# EAGLE design stm32 (EAGLE 7.2.0)
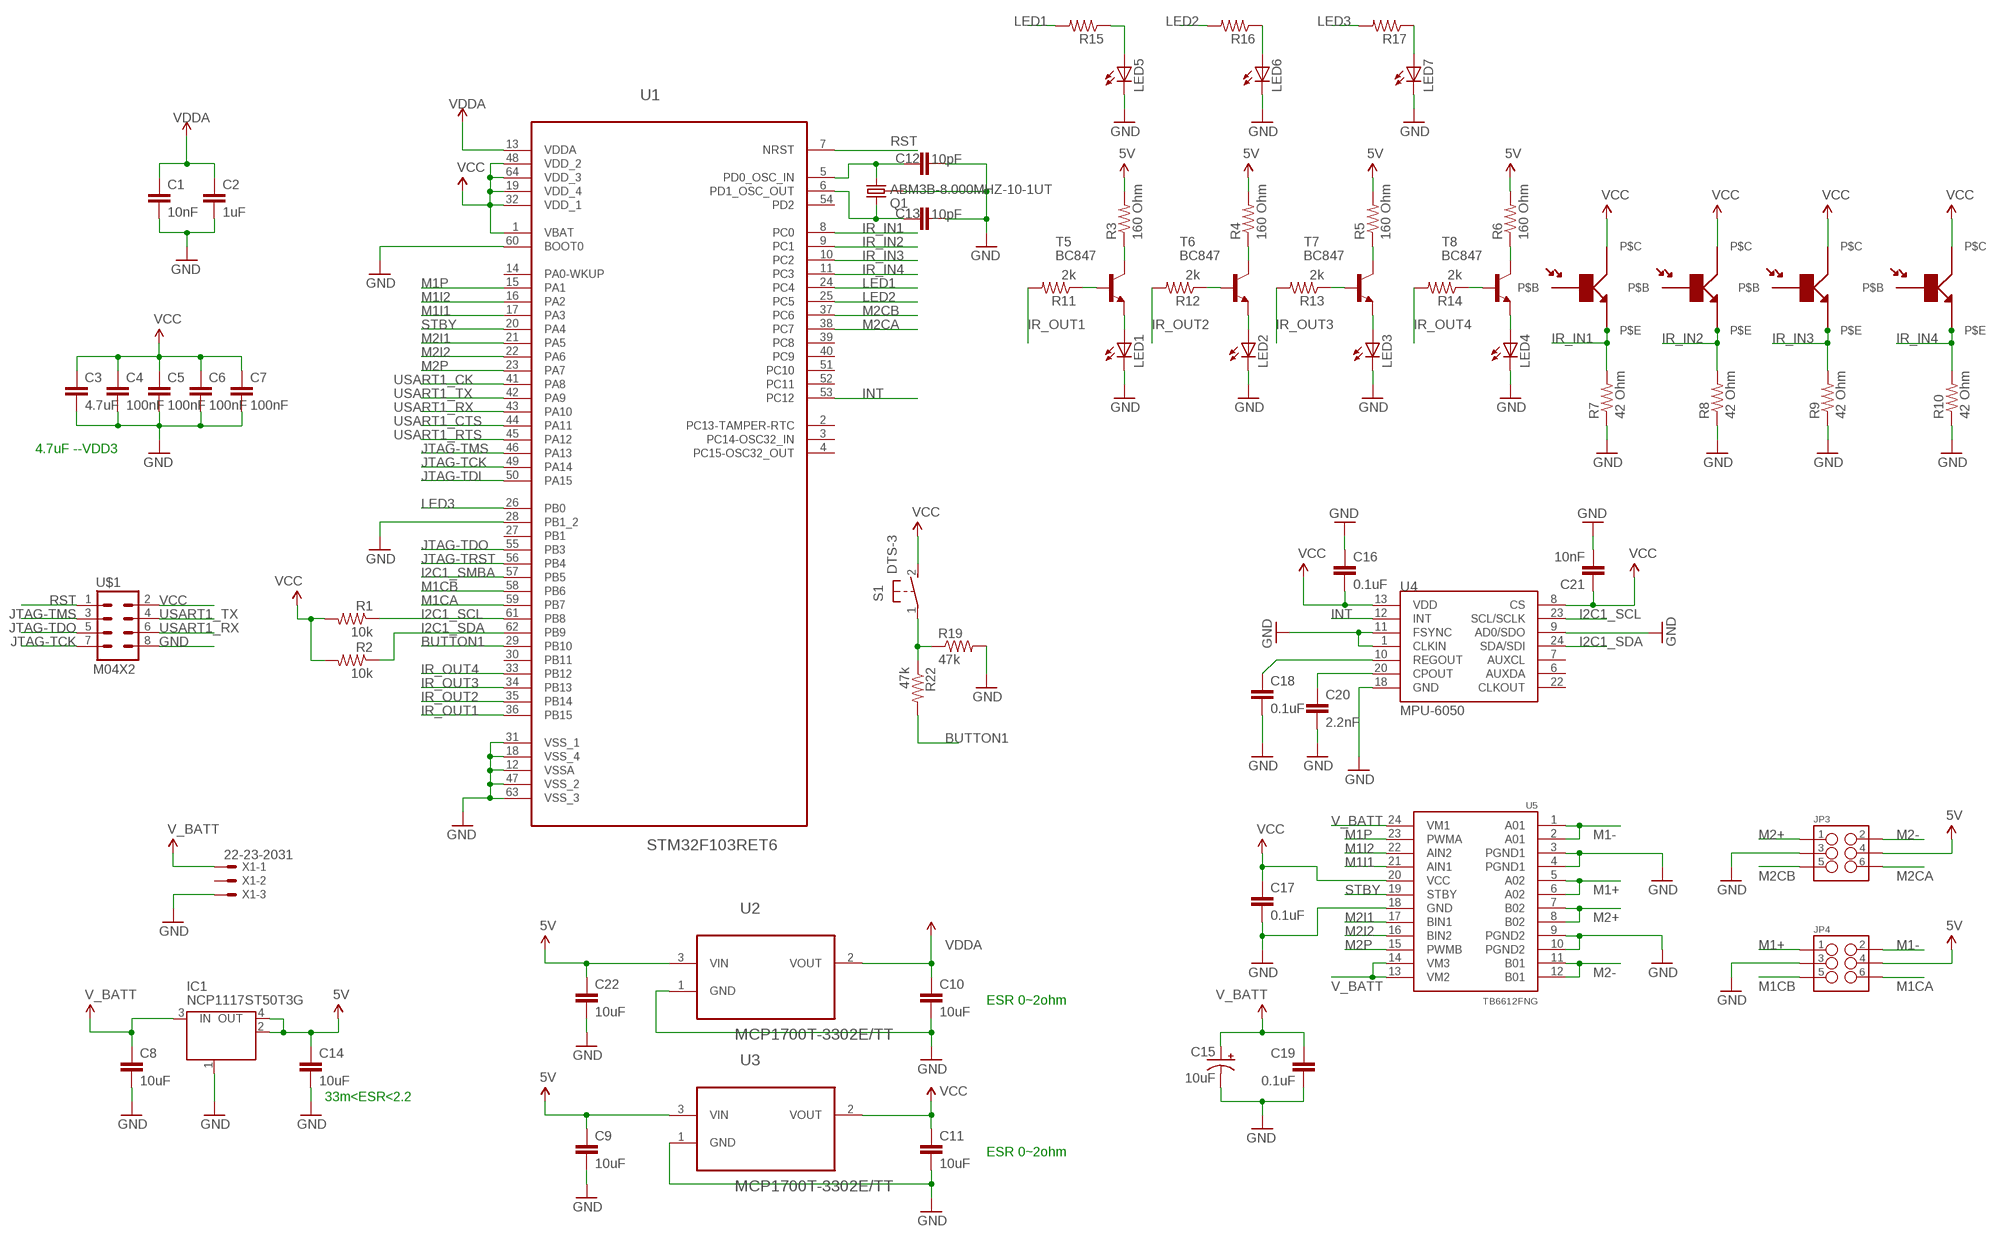
[diagram p0: schematic, sheet 1]

## Parts
C1  10nF  CAP0805  [0805]
C2  1uF  CAP0805  [0805]
C3  4.7uF  CAP0805  [0805]
C4  100nF  CAP0805  [0805]
C5  100nF  CAP0805  [0805]
C6  100nF  CAP0805  [0805]
C7  100nF  CAP0805  [0805]
C8  10uF  CAP0805  [0805]
C9  10uF  CAP0805  [0805]
C10  10uF  CAP0805  [0805]
C11  10uF  CAP0805  [0805]
C12  10pF  CAP0805  [0805]
C13  10pF  CAP0805  [0805]
C14  10uF  CAP0805  [0805]
C15  10uF  CAP_POL1206-KIT  [EIA3216-KIT]
C16  0.1uF  CAP0805  [0805]
C17  0.1uF  CAP0805  [0805]
C18  0.1uF  CAP0805  [0805]
C19  0.1uF  CAP0805  [0805]
C20  2.2nF  CAP0805  [0805]
C21  10nF  CAP0805  [0805]
C22  10uF  CAP0805  [0805]
IC1  NCP1117ST50T3G  MC33269ST-3.3T3  [SOT223]
JP3  M03X2NO_SILK  [2X3-NS]
JP4  M03X2NO_SILK  [2X3-NS]
LED1  LED5MM  [LED5MM]
LED2  LED5MM  [LED5MM]
LED3  LED5MM  [LED5MM]
LED4  LED5MM  [LED5MM]
LED5  LEDSML0805  [SML0805]
LED6  LEDSML0805  [SML0805]
LED7  LEDSML0805  [SML0805]
Q1  ABM3B-8.000MHZ-10-1UT  CRYSTAL-GROUNDED  [CRYSTAL-SMD-5X3]
R1  10k  RESISTOR0805-RES  [0805]
R2  10k  RESISTOR0805-RES  [0805]
R3  160 Ohm  RESISTOR0805-RES  [0805]
R4  160 Ohm  RESISTOR0805-RES  [0805]
R5  160 Ohm  RESISTOR0805-RES  [0805]
R6  160 Ohm  RESISTOR0805-RES  [0805]
R7  42 Ohm  RESISTOR0805-RES  [0805]
R8  42 Ohm  RESISTOR0805-RES  [0805]
R9  42 Ohm  RESISTOR0805-RES  [0805]
R10  42 Ohm  RESISTOR0805-RES  [0805]
R11  2k  RESISTOR0805-RES  [0805]
R12  2k  RESISTOR0805-RES  [0805]
R13  2k  RESISTOR0805-RES  [0805]
R14  2k  RESISTOR0805-RES  [0805]
R15  RESISTOR0805-RES  [0805]
R16  RESISTOR0805-RES  [0805]
R17  RESISTOR0805-RES  [0805]
R19  47k  RESISTOR0805-RES  [0805]
R22  47k  RESISTOR0805-RES  [0805]
S1  DTS-3  [DTS-3]
T5  BC847  [SOT23]
T6  BC847  [SOT23]
T7  BC847  [SOT23]
T8  BC847  [SOT23]
U1  STM32F103RET6  [QFP50P1200X1200X160-64N]
U2  MCP1700T-3302E/TT  [SOT95P237X112-3N]
U3  MCP1700T-3302E/TT  [SOT95P237X112-3N]
U4  MPU-6050  MPU-6000QFN-24  [QFN-24-TESTING]
U5  TB6612FNG  [SSOP24]
U$1  M04X2  [2X4]
U$2  PHTRST  [PHTRST]
U$3  PHTRST  [PHTRST]
U$4  PHTRST  [PHTRST]
U$5  PHTRST  [PHTRST]
X1  22-23-2031  [22-23-2031]

## Nets
5V: C9.1 C14.1 C22.1 IC1.2(OUT) IC1.4(OUT) JP3.4 JP4.4 R3.2 R4.2 R5.2 R6.2 U2.3(VIN) U3.3(VIN)
BUTTON1: R22.2 U1.29(PB10)
GND: C1.2 C2.2 C3.2 C4.2 C5.2 C6.2 C7.2 C8.2 C9.2 C10.2 C11.2 C12.1 C13.1 C14.2 C15.C(-) C16.1 C17.2 C18.2 C19.2 C20.2 C21.2 C22.2 IC1.1(GND/ADJ) JP3.3 JP4.3 LED1.K(C) LED2.K(C) LED3.K(C) LED4.K(C) LED5.C LED6.C LED7.C Q1.2 Q1.4 R7.1 R8.1 R9.1 R10.1 R19.2 U1.12(VSSA) U1.18(VSS_4) U1.28(PB1_2) U1.31(VSS_1) U1.47(VSS_2) U1.60(BOOT0) U1.63(VSS_3) U2.1(GND) U3.1(GND) U4.1(CLKIN) U4.9(AD0/SDO) U4.11(FSYNC) U4.18(GND) U5.3(PGND1) U5.4(PGND1) U5.9(PGND2) U5.10(PGND2) U5.18(GND) U$1.8 X1.3
I2C1_SCL: R1.1 U1.61(PB8) U4.23(SCL/SCLK)
I2C1_SDA: R2.1 U1.62(PB9) U4.24(SDA/SDI)
I2C1_SMBA: U1.57(PB5)
INT: U1.53(PC12) U4.12(INT)
IR_IN1: R7.2 U1.8(PC0) U$2.P$E
IR_IN2: R8.2 U1.9(PC1) U$3.P$E
IR_IN3: R9.2 U1.10(PC2) U$4.P$E
IR_IN4: R10.2 U1.11(PC3) U$5.P$E
IR_OUT1: R11.2 U1.36(PB15)
IR_OUT2: R12.2 U1.35(PB14)
IR_OUT3: R13.2 U1.34(PB13)
IR_OUT4: R14.2 U1.33(PB12)
JTAG-TCK: U1.49(PA14) U$1.7
JTAG-TDI: U1.50(PA15)
JTAG-TDO: U1.55(PB3) U$1.5
JTAG-TMS: U1.46(PA13) U$1.3
JTAG-TRST: U1.56(PB4)
LED1: R15.2 U1.24(PC4)
LED2: R16.2 U1.25(PC5)
LED3: R17.2 U1.26(PB0)
M1+ [MOTOR]: JP4.1 U5.5(A02) U5.6(A02)
M1- [MOTOR]: JP4.2 U5.1(A01) U5.2(A01)
M1CA: JP4.6 U1.59(PB7)
M1CB: JP4.5 U1.58(PB6)
M1I1: U1.17(PA3) U5.21(AIN1)
M1I2: U1.16(PA2) U5.22(AIN2)
M1P: U1.15(PA1) U5.23(PWMA)
M2+ [MOTOR]: JP3.1 U5.7(B02) U5.8(B02)
M2- [MOTOR]: JP3.2 U5.11(B01) U5.12(B01)
M2CA: JP3.6 U1.38(PC7)
M2CB: JP3.5 U1.37(PC6)
M2I1: U1.21(PA5) U5.17(BIN1)
M2I2: U1.22(PA6) U5.16(BIN2)
M2P: U1.23(PA7) U5.15(PWMB)
N$2: C12.2 Q1.3 U1.5(PD0_OSC_IN)
N$3: R4.1 T6.3(C)
N$4: LED1.A T5.2(E)
N$5: LED2.A T6.2(E)
N$6: C13.2 Q1.1 U1.6(PD1_OSC_OUT)
N$7: LED3.A T7.2(E)
N$9: C20.1 U4.20(CPOUT)
N$10: C18.1 U4.10(REGOUT)
N$14: LED4.A T8.2(E)
N$15: R3.1 T5.3(C)
N$16: R5.1 T7.3(C)
N$17: R6.1 T8.3(C)
N$22: R14.1 T8.1(B)
N$23: R13.1 T7.1(B)
N$24: R12.1 T6.1(B)
N$25: R11.1 T5.1(B)
N$26: LED5.A R15.1
N$27: LED6.A R16.1
N$28: LED7.A R17.1
N$31: R19.1 R22.1 S1.1
RST: U1.7(NRST) U$1.1
STBY: U1.20(PA4) U5.19(STBY)
USART1_CK: U1.41(PA8)
USART1_CTS: U1.44(PA11)
USART1_RTS: U1.45(PA12)
USART1_RX: U1.43(PA10) U$1.6
USART1_TX: U1.42(PA9) U$1.4
V_BATT [MOTOR]: C8.1 C15.A(+) C19.1 IC1.3(IN) U5.13(VM2) U5.14(VM3) U5.24(VM1) X1.1
VCC: C3.1 C4.1 C5.1 C6.1 C7.1 C11.1 C16.2 C17.1 C21.1 R1.2 R2.2 S1.2 U1.1(VBAT) U1.19(VDD_4) U1.32(VDD_1) U1.48(VDD_2) U1.64(VDD_3) U3.2(VOUT) U4.8(CS) U4.13(VDD) U5.20(VCC) U$1.2 U$2.P$C U$3.P$C U$4.P$C U$5.P$C
VDD: C1.1 C2.1 C10.1 U1.13(VDDA) U2.2(VOUT) ; supply symbol labelled VDDA
Unconnected: U1.2(PC13-TAMPER-RTC) U1.3(PC14-OSC32_IN) U1.4(PC15-OSC32_OUT) U1.14(PA0-WKUP) U1.27(PB1) U1.30(PB11) U1.39(PC8) U1.40(PC9) U1.51(PC10) U1.52(PC11) U1.54(PD2) U4.6(AUXDA) U4.7(AUXCL) U4.22(CLKOUT) U$2.P$B U$3.P$B U$4.P$B U$5.P$B X1.2

## Notes on the sheet
- 4.7uF --VDD3
- ESR 0~2ohm
- 33m<ESR<2.2
- ESR 0~2ohm

## Library data of the parts
C1-C14 C16-C22 = SparkFun-Capacitors:CAP: Capacitor Standard 0603 ceramic capacitor, and 0.1" leaded capacitor.
C15 = SparkFun-Capacitors:CAP_POL: Capacitor Polarized These are standard SMD and PTH capacitors. Normally 10uF, 47uF, and 100uF in electrolytic and tantalum varieties. Always verify the external diameter of the through hole cap, it varies with capacity, voltage, and manufacturer. The EIA devices should be standard.
IC1 = linear:MC33269ST*: Adjustable Output Low Dropout Voltage Regulator 800 mA Source: http://www.onsemi.com/pub/Collateral/MC33269-D.PDF
JP3 JP4 = SparkFun-Connectors:M03X2: 2x3 .1" header. Shrouded, with keying- CONN-10681 SMT- CONN-11415 Pogo pins- HW-11044
LED1-LED7 = led:LED: LED OSRAM: - CHIPLED LG R971, LG N971, LY N971, LG Q971, LY Q971, LO R971, LY R971 LH N974, LH R974 LS Q976, LO Q976, LY Q976 LO Q996 - Hyper CHIPLED LW Q18S LB Q993, LB Q99A, LB R99A - SideLED LS A670, LO A670, LY A670, LG A670, LP A670 LB A673, LV A673, LT A673, LW A673 LH A674 LY A675 LS A676, LA A676, LO A676, LY A676, LW A676 LS A679, LY A679, LG A679 - Hyper Micro SIDELED® LS Y876, LA Y876, LO Y876, LY Y876 LT Y87S - SmartLED LW L88C, LW L88S LB L89C, LB L89S, LG L890 LS L89K, LO L89K, LY L89K LS L896, LA L896, LO L896, LY L896 - TOPLED LS T670, LO T670, LY T670, LG T670, LP T670 LSG T670, LSP T670, LSY T670, LOP T670, LYG T670 LG T671, LOG T671, LSG T671 LB T673, LV T673, LT T673, LW T673 LH T674 LS T676, LA T676, LO T676, LY T676, LB T676, LH T676, LSB T676, LW T676 LB T67C, LV T67C, LT T67C, LS T67K, LO T67K, LY T67K, LW E67C LS E67B, LA E67B, LO E67B, LY E67B, LB E67C, LV E67C, LT E67C LW T67C LS T679, LY T679, LG T679 LS T770, LO T770, LY T770, LG T770, LP T770 LB T773, LV T773, LT T773, LW T773 LH T774 LS E675, LA E675, LY E675, LS T675 LS T776, LA T776, LO T776, LY T776, LB T776 LHGB T686 LT T68C, LB T68C - Hyper Mini TOPLED® LB M676 - Mini TOPLED Santana® LG M470 LS M47K, LO M47K, LY M47K Source: http://www.osram.convergy.de LUXEON: - LUMILED® LXK2-PW12-R00, LXK2-PW12-S00, LXK2-PW14-U00, LXK2-PW14-V00 LXK2-PM12-R00, LXK2-PM12-S00, LXK2-PM14-U00 LXK2-PE12-Q00, LXK2-PE12-R00, LXK2-PE12-S00, LXK2-PE14-T00, LXK2-PE14-U00 LXK2-PB12-K00, LXK2-PB12-L00, LXK2-PB12-M00, LXK2-PB14-N00, LXK2-PB14-P00, LXK2-PB14-Q00 LXK2-PR12-L00, LXK2-PR12-M00, LXK2-PR14-Q00, LXK2-PR14-R00 LXK2-PD12-Q00, LXK2-PD12-R00, LXK2-PD12-S00 LXK2-PH12-R00, LXK2-PH12-S00 LXK2-PL12-P00, LXK2-PL12-Q00, LXK2-PL12-R00 Source: www.luxeon.com KINGBRIGHT: KA-3528ASYC Source: www.kingbright.com
Q1 = SparkFun-FreqCtrl:CRYSTAL-GROUNDED
R1 R2 = SparkFun-Passives:RESISTOR: Resistor Basic schematic elements and footprints for 0603, 1206, and PTH resistors.
R3-R17 R19 R22 = SparkFun-Resistors:RESISTOR: Resistor Basic schematic elements and footprints for 0603, 1206, and PTH resistors.
S1 = switch-tact copy:DTS-3
T5-T8 = transistor:BC847: NPN TRANSISTOR
U1 = ST Microelctronics_By_element14_Batch_1:STM32F103RET6: ARM-based 32-bit MCU; MPN: STM32F103RET6; OC_FARNELL: 1624138; OC_NEWARK: 01P4101; PACKAGE: QFP-64; SUPPLIER: STMICROELECTRONICS
U2 U3 = Microchip_By_element14_Batch_1:MCP1700T-3302E/TT: Low Quiescent Current LDO; MPN: MCP1700T-3302E/TT; OC_FARNELL: 1296592; OC_NEWARK: 88H9817; PACKAGE: SOT23-3; SUPPLIER: Microchip
U4 = SparkFun-Sensors:MPU-6000: MPU-6000 - I2C address is 0x68 with AD0 low and 0x69 with AD0 high.
U5 = SparkFun-PowerIC:TB6612FNG: Toshiba 1A dual motor driver IC-09363; PROD_ID: IC-09363
U$1 = SparkFun-Connectors:M04X2: .1" header, two rows of four.
U$2-U$5 = phototransistor:PHTRST
X1 = battery_plug:22-23-2031: .100" (2.54mm) Center Header - 3 Pin

## Net classes
0 default: width 0.254 mm
1 MOTOR: width 0.254 mm

## Board
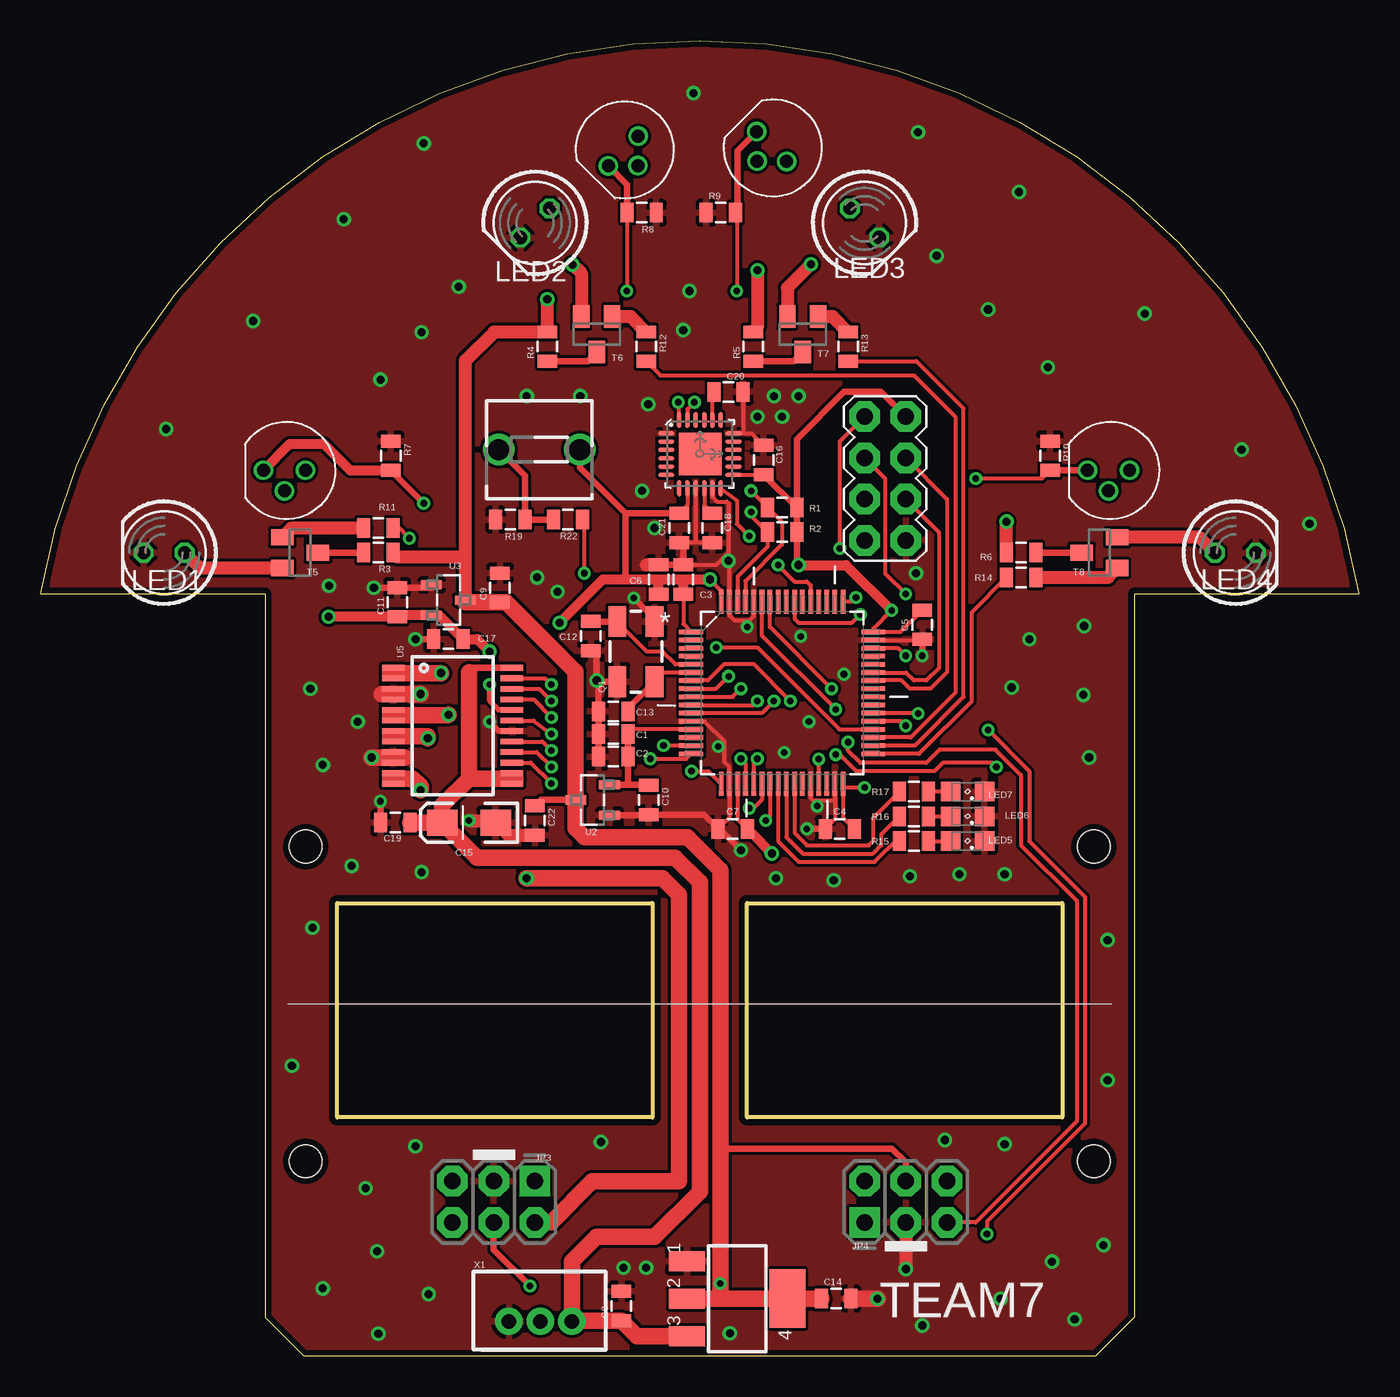
[diagram p1: board, top side]
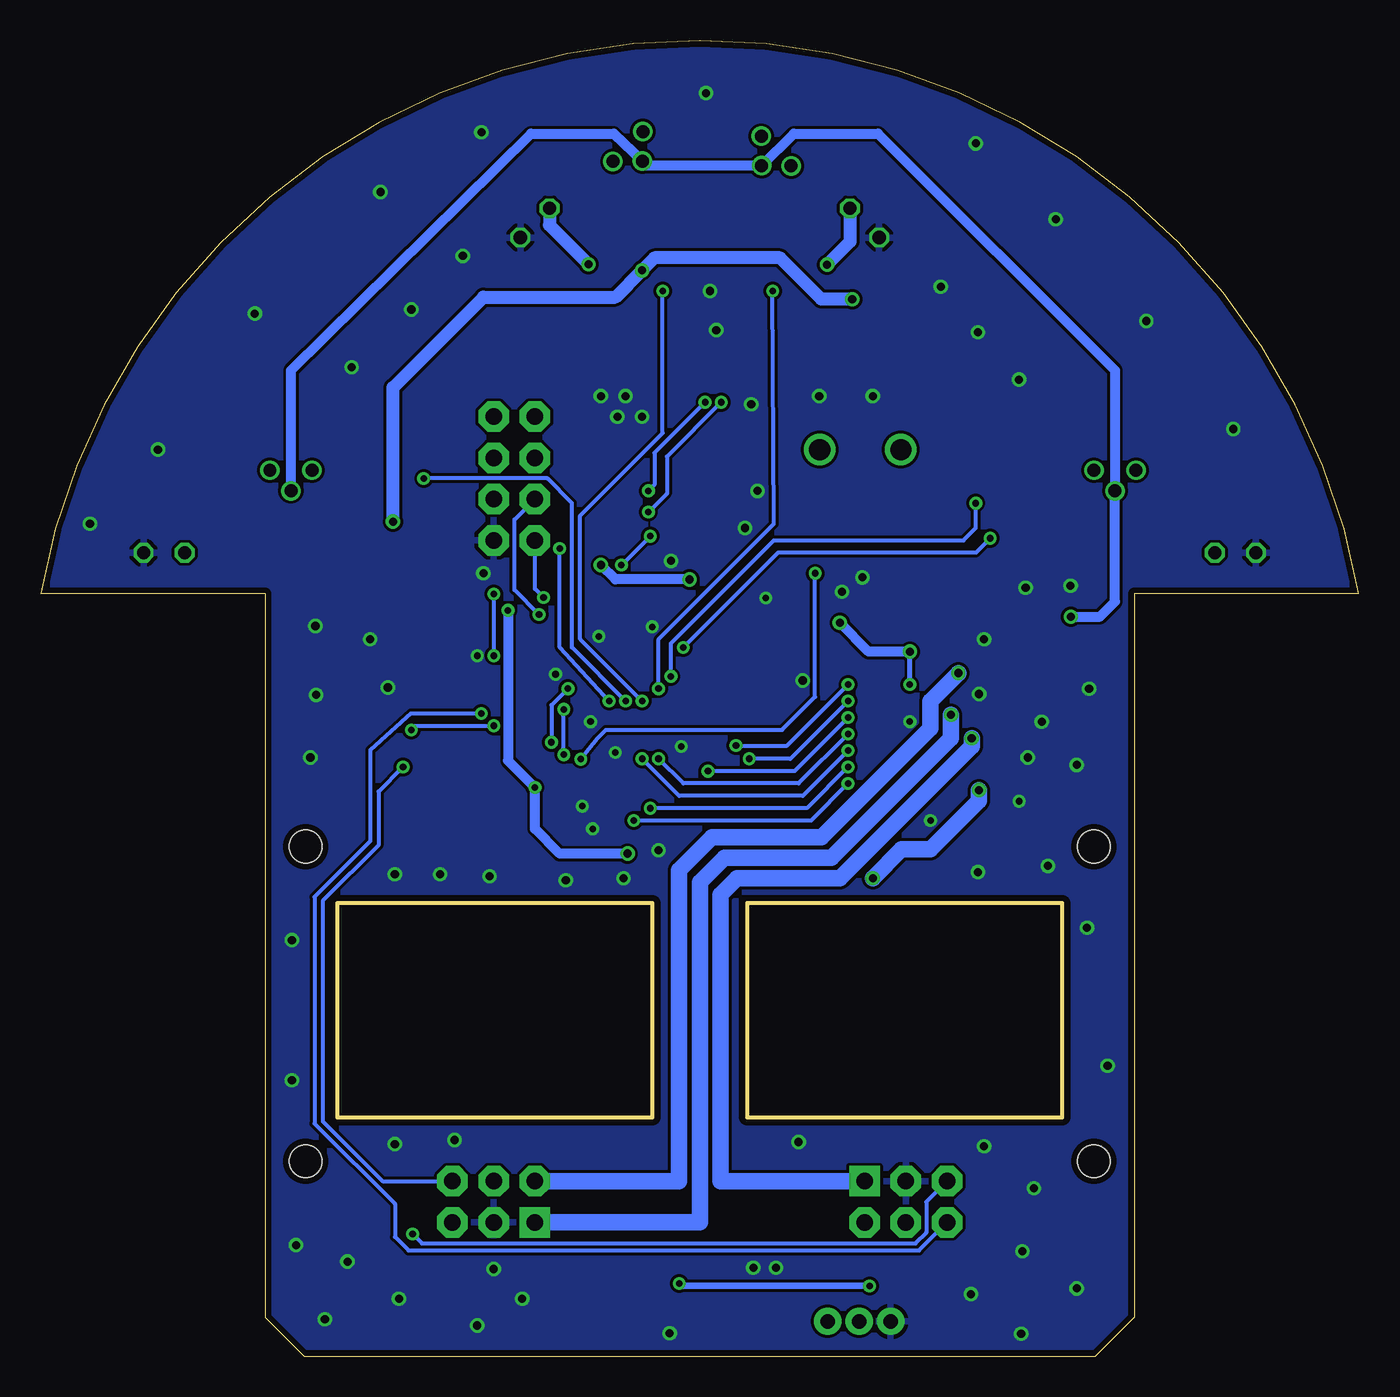
[diagram p2: board, bottom side, seen from below]

Size 81.28 x 81.09 mm. Coordinates in mm from the lower left corner, seen from the top.
Outline: 0,46.99 13.84,46.99 13.84,2.41 16.26,0 65.02,0 67.44,2.41 67.44,46.99 81.28,46.99 arc160 0,46.99
Copper layers (1*16): Top 0.0356mm / dielectric 1.5011mm / Bottom 0.0356mm
Design rules "PCBOrder_7 mil": minimum track width 7mil, minimum drill 15mil, track to track 7mil, track to pad 7mil, pad to pad 7mil, via to via 7mil, smd to smd 7mil, copper to edge 15mil, drill to drill 7mil, minimum pad ring 7.5mil, minimum via ring 7.5mil, stop-mask expansion 4mil, vias tented up to drill 16mil, thermal gap 10mil
Holes 2.01 mm at 64.94,31.42 64.94,12.02 16.34,31.42 16.34,12.02

### Footprints (pad centres in the part's own frame; a part is rotated, then mirrored left to right if it is on the bottom)
0805 = smd 0.8 x 1.2: 1 -0.9,0; 2 0.9,0
EIA3216-KIT = smd 1.9 x 1.6: A 1.65,0; C -1.65,0
SOT223 = smd 1.219 x 2.235: 1 -2.311,-3.099; 2 0,-3.099; 3 2.311,-3.099 | smd 3.6 x 2.2: 4 0,3.099
2X3-NS = drill 1.016 pad 1.88 square: 1 -2.54,-1.27 | drill 1.016 pad 1.88 octagon: 2 -2.54,1.27; 3 0,-1.27; 4 0,1.27; 5 2.54,-1.27; 6 2.54,1.27
LED5MM = drill 0.813 octagon: A -1.27,0; K 1.27,0
SML0805 = smd 1.2 x 1.2: A 1.05,0; C -1.05,0
CRYSTAL-SMD-5X3 = smd 1.9 x 1.1: 1 -1.85,-1.15; 2 1.85,-1.15; 3 1.85,1.15; 4 -1.85,1.15
DTS-3 = drill 1.3: 1 -3.25,0; 2 1.75,0
SOT23 = smd 1 x 1.4: 1 -0.95,-1.1; 2 0.95,-1.1; 3 0,1.1
QFP50P1200X1200X160-64N = smd 1.473 x 0.279: 1 -5.613,3.759; 2 -5.613,3.251; 3 -5.613,2.743; 4 -5.613,2.261; 5 -5.613,1.753; 6 -5.613,1.245; 7 -5.613,0.762; 8 -5.613,0.254; 9 -5.613,-0.254; 10 -5.613,-0.762; 11 -5.613,-1.245; 12 -5.613,-1.753; 13 -5.613,-2.261; 14 -5.613,-2.743; 15 -5.613,-3.251; 16 -5.613,-3.759; 33 5.613,-3.759; 34 5.613,-3.251; 35 5.613,-2.743; 36 5.613,-2.261; 37 5.613,-1.753; 38 5.613,-1.245; 39 5.613,-0.762; 40 5.613,-0.254; 41 5.613,0.254; 42 5.613,0.762; 43 5.613,1.245; 44 5.613,1.753; 45 5.613,2.261; 46 5.613,2.743; 47 5.613,3.251; 48 5.613,3.759 | smd 0.279 x 1.473: 17 -3.759,-5.613; 18 -3.251,-5.613; 19 -2.743,-5.613; 20 -2.261,-5.613; 21 -1.753,-5.613; 22 -1.245,-5.613; 23 -0.762,-5.613; 24 -0.254,-5.613; 25 0.254,-5.613; 26 0.762,-5.613; 27 1.245,-5.613; 28 1.753,-5.613; 29 2.261,-5.613; 30 2.743,-5.613; 31 3.251,-5.613; 32 3.759,-5.613; 49 3.759,5.613; 50 3.251,5.613; 51 2.743,5.613; 52 2.261,5.613; 53 1.753,5.613; 54 1.245,5.613; 55 0.762,5.613; 56 0.254,5.613; 57 -0.254,5.613; 58 -0.762,5.613; 59 -1.245,5.613; 60 -1.753,5.613; 61 -2.261,5.613; 62 -2.743,5.613; 63 -3.251,5.613; 64 -3.759,5.613
SOT95P237X112-3N = smd 0.559 x 1.27: 1 -0.94,-1.041; 2 0.94,-1.041; 3 0,1.041
QFN-24-TESTING = smd 1.016 x 0.254: 1 -2.066,1.257; 2 -2.066,0.75; 3 -2.066,0.247; 4 -2.066,-0.287; 5 -2.066,-0.792; 6 -2.066,-1.297; 13 2.086,-1.297; 14 2.086,-0.792; 15 2.086,-0.287; 16 2.086,0.247; 17 2.086,0.75; 18 2.086,1.257 | smd 0.254 x 1.016: 7 -1.267,-2.122; 8 -0.762,-2.122; 9 -0.258,-2.122; 10 0.278,-2.122; 11 0.78,-2.122; 12 1.287,-2.122; 19 1.287,2.082; 20 0.78,2.082; 21 0.278,2.082; 22 -0.258,2.082; 23 -0.762,2.082; 24 -1.267,2.082 | smd 2.616 x 2.616: P$1 0.02,-0.01
SSOP24 = smd 0.348 x 1.397: 1 -3.575,-3.656; 2 -2.925,-3.656; 3 -2.275,-3.656; 4 -1.625,-3.656; 5 -0.975,-3.656; 6 -0.325,-3.656; 7 0.325,-3.656; 8 0.975,-3.656; 9 1.625,-3.656; 10 2.275,-3.656; 11 2.925,-3.656; 12 3.575,-3.656; 13 3.575,3.656; 14 2.925,3.656; 15 2.275,3.656; 16 1.625,3.656; 17 0.975,3.656; 18 0.325,3.656; 19 -0.325,3.656; 20 -0.975,3.656; 21 -1.625,3.656; 22 -2.275,3.656; 23 -2.925,3.656; 24 -3.575,3.656
2X4 = drill 1.016 pad 1.88 octagon: 1 -3.81,-1.27; 2 -3.81,1.27; 3 -1.27,-1.27; 4 -1.27,1.27; 5 1.27,-1.27; 6 1.27,1.27; 7 3.81,-1.27; 8 3.81,1.27
PHTRST = drill 0.8: P$B 0,1.1; P$C 1.27,-0.2; P$E 0,-1.5
22-23-2031 = drill 0.9 pad 1.676: 1 -1.74,1.4; 2 0.2,1.4; 3 2.14,1.4

### Placement (x,y rotation side)
C1  35.31,38.35 180 top
C2  35.31,36.96 180 top
C3  39.62,47.88 90 top
C4  49.28,32.51 180 top
C5  54.36,45.09 270 top
C6  38.1,47.88 90 top
C7  42.67,32.51 180 top
C8  35.81,3.1 90 top
C9  28.32,47.37 90 top
C10  37.49,34.29 270 top
C11  22,46.48 90 top
C12  33.93,44.4 90 top
C13  35.31,39.75 0 top
C14  49.05,3.56 0 top
C15  26.42,32.89 180 top
C16  44.58,55.24 270 top
C17  25.15,44.2 180 top
C18  41.4,51.05 270 top
C19  21.87,32.89 180 top
C20  42.42,59.44 0 top
C21  39.37,51.05 270 top
C22  30.48,33.02 270 top
IC1  42.95,3.56 270 top
JP3  27.94,9.53 180 top
JP4  53.34,9.53 0 top
LED1  7.62,49.53 180 top
LED2  30.48,69.85 225 top
LED3  50.8,69.85 315 top
LED4  73.66,49.53 0 top
LED5  57.15,31.75 180 top
LED6  57.15,33.27 180 top
LED7  57.15,34.8 180 top
Q1  36.7,43.43 90 top
R1  45.72,52.32 0 top
R2  45.72,50.8 0 top
R3  20.83,49.53 0 top
R4  31.24,62.23 90 top
R5  43.94,62.23 90 top
R6  60.45,49.53 180 top
R7  21.59,55.5 270 top
R8  37.06,70.48 180 top
R9  41.94,70.48 0 top
R10  62.23,55.5 270 top
R11  20.83,51.05 0 top
R12  37.34,62.23 270 top
R13  49.78,62.23 270 top
R14  60.45,48.01 180 top
R15  53.85,31.75 180 top
R16  53.85,33.27 180 top
R17  53.85,34.8 180 top
R19  28.96,51.56 180 top
R22  32.51,51.56 0 top
S1  31.5,55.88 0 top
T5  16,49.53 270 top
T6  34.29,62.99 180 top
T7  46.99,62.99 180 top
T8  65.28,49.53 90 top
U1  45.72,40.89 0 top
U2  34.04,34.29 90 top
U3  25.15,46.61 270 top
U4  40.64,55.63 0 top
U5  25.4,38.86 270 top
U$1  52.07,54.1 270 top
U$2  15.24,54.61 270 top
U$3  36.07,74.42 315 top
U$4  45.21,74.42 225 top
U$5  66.04,54.61 270 top
X1  31.01,3.56 180 top

### Tracks (layer width: path | path; a pad name or v marks a point on that pad's centre or on a via)
5V  (via drill 0.41, 0.5)
  Top 0.254: 25.7,46.63 U3.3 | 29.21,45.59 29.6,45.58
  Top 0.406: U2.3 30.85,34.29 C22.1 | JP3.4 27.94,6.58 v30.17,4.34 | JP4.4 53.34,11.96 52.5,12.8 42.06,12.8 41.91,12.65
  Top 0.813: v31.24,65.15 R4.2 27.95,63.13 26.19,61.37 26.19,49.28 | v44.2,66.93 44.2,63.38 R5.2 | R6.2 v59.55,51.45 | 26.19,49.28 U3.3 | R3.2 21.98,49.28 26.19,49.28
  Top 1.016: C14.1 IC1.4 41.91,3.56 | 41.91,3.56 v41.91,4.5 41.91,12.65 41.91,29.97 39.88,32 33.53,32 32.99,32.54 U2.3 32.99,42.19 29.6,45.58 28.71,46.47 C9.1 26.2,46.47 U3.3 | IC1.2 41.91,3.56
  Bottom 0.406: v30.17,4.34 41.76,4.34 v41.91,4.5
  Bottom 0.813: v31.24,65.15 33.15,65.15 35.69,67.69 43.43,67.69 v44.2,66.93 45.85,65.28 53.98,65.28 59.55,59.7 v59.55,51.45
BUTTON1  (via drill 0.41)
  Top 0.254: U1.29 v47.98,36.8 | v33.53,48.26 33.53,51.45 R22.2
  Bottom 0.254: v47.98,36.8 46.94,38.1 46.43,38.61 35.56,38.61 33.53,40.64 v33.53,48.26
GND  (via drill 0.41, 0.5)
  Top 0.254: U4.9 40.38,50.15 | C7.2 42.47,33.21 U1.18 42.47,36.32 42.16,36.63 42.16,37.9 40.95,39.12 40.13,39.12 U1.12 | U1.31 48.97,34.24 | 48.97,34.24 48.97,33.11 C4.2 | U5.4 21.74,40.54 U5.3 21.24,40.82 | 21.64,37.29 U5.9 U5.10 21.74,36.91 22.45,36.91 | 48.97,34.24 47.65,34.24 47.47,34.42 U1.28 | 41.86,32.51 C7.2 | 41.45,32.71 41.66,32.51 C7.2 | 24.13,44.32 C17.2 | 54.02,44.14 C5.2 54.14,44.14 U1.47 | C18.2 40.39,50.15 40.38,50.15 | 40.38,50.15 C21.2 | C3.2 39.63,48.77 41.66,48.77 42.42,49.53 42.42,52.55 42.29,52.68 41.71,52.68 41.42,52.97 U4.11 | C20.2 43.32,56.88 U4.18 43.84,56.88 C16.1 | 42.42,48.77 42.47,48.72 U1.63 42.47,45.67 42.8,45.34 43.69,45.34 43.97,45.62 U1.60
  Top 0.305: U5.18 28.27,38.54 v27.69,39.12
  Top 0.406: v47.24,32.51 C4.2 | v43.18,31.19 41.86,32.51 | U2.1 37.45,33.35 C10.2 40.89,33.39 C7.2 | C6.2 C3.2 39.62,49.9 C21.2 | C2.2 C1.2 C13.1 34.41,41.54 v34.29,41.66 | 24.13,47.42 U3.1 24.1,47.38 C11.2 20.56,47.38 v20.55,47.37 | Q1.4 34.36,41.58 v34.29,41.66 | v34.29,41.66 34.29,43.14 C12.1 | C5.2 v54.36,43.18 | C17.2 v23.11,44.2 | C19.2 20.97,34.2 v20.95,34.21 | Q1.2 37.85,45.46 v36.58,46.74
  Top 0.813: v26.42,33.02 27.94,33.02 | C15.C 28.84,32.12 C22.2 | JP4.3 v53.34,5.38 | C6.2 37.34,48.78
  Top 1.016: 27.94,33.02 C15.C | C14.2 v51.59,3.56 | v23.42,40.82 21.24,40.82 21.03,40.82 | v20.42,36.91 22.45,36.91
  other vias: 37.34,5.46 35.94,5.46 45.21,59.18 46.74,59.18 45.72,57.91 44.2,57.91 37.85,51.05 42.42,49.02 60.96,44.2 64.34,45.01 64.29,40.77 64.64,36.91 59.44,29.72 53.59,29.59 45.34,29.46 48.89,29.34 55.75,13.33 59.44,13.08 65.53,6.86 62.36,5.84 63.75,2.29 59.18,3.56 54.36,1.9 23.93,3.84 20.75,6.48 20.04,10.36 23.11,12.95 34.54,13.21 17.4,4.19 20.83,1.4 15.49,17.91 16.76,26.42 19.56,39.12 16.64,41.15 17.4,36.45 7.75,57.15 20.95,60.2 23.49,63.12 25.78,65.91 47.37,39.12 78.23,51.31 74.04,55.88 68.07,64.26 60.32,71.75 54.1,75.44 62.1,60.96 58.42,64.52 55.24,67.82 40,65.66 39.62,63.25 33.27,59.18 29.97,59.18 18.69,70.08 23.62,74.75 40.26,77.85 43.56,44.96 46.86,44.37 49.53,42.04 19.18,30.23 23.49,29.85 17.78,47.5 30.61,48.01 31.88,47.12 59.87,41.22 41.78,37.59 45.85,37.21 37.46,58.67 37.08,53.34 56.64,29.72 65.79,25.65 65.79,17.02 53.98,48.26 47.88,33.91 13.11,63.8 42.49,1.42
  pour Top: 35.23,6.32 35.23,3.71 37.87,3.63 37.87,4.57 39.9,4.57 39.9,6.25
  pour Top: 36.83,50.55 42.93,50.55 42.93,48.51 36.83,48.51
  pour Top: -0.51,82.04 82.04,82.04 82.04,-3.05 -0.51,-3.05
  pour Bottom: -0.51,82.04 82.04,82.04 82.04,-3.05 -0.51,-3.05
I2C1_SCL  (via drill 0.41)
  Top 0.254: U4.23 39.88,58.37 v40.31,58.8 | v43.8,53.34 R1.1 45.72,51.42 45.72,50.04 43.46,47.78 U1.61
  Bottom 0.254: v40.31,58.8 43.43,55.68 43.43,53.71 v43.8,53.34
I2C1_SDA  (via drill 0.41)
  Top 0.254: U4.24 39.37,58.75 v39.32,58.8 | v43.8,52.03 43.8,51.82 R2.1 44.82,49.9 42.98,48.06 U1.62
  Bottom 0.254: v39.32,58.8 42.67,55.45 42.67,53.17 v43.8,52.03
INT  (via drill 0.41)
  Top 0.254: U4.12 42.93,52.76 42.93,51.31 v43.69,50.55 | v45.47,48.77 46.48,47.75 47.24,47.75 47.47,47.52 U1.53
  Bottom 0.254: v43.69,50.55 v45.47,48.77
IR_IN1  (via drill 0.41)
  Top 0.254: U1.8 41.66,41.15 v42.42,41.91 | R7.2
  Top 0.406: v23.62,52.58 23.61,52.58 R7.2
  Top 0.61: U$2.P$E 15.37,56.24 17.45,56.24 19.09,54.6 R7.2
  Top 0.813: 21.58,54.61 R7.2
  Bottom 0.254: v42.42,41.91 42.42,43.94 36.07,50.29 24.38,50.29 23.62,51.05 v23.62,52.58
IR_IN2  (via drill 0.41)
  Top 0.254: U1.9 42.67,40.64 v43.18,41.15 | R8.2 36.14,70.47 v36.14,65.66
  Top 0.406: R8.2 36.16,72.21 U$3.P$E
  Bottom 0.254: v43.18,41.15 43.18,44.2 36.07,51.31 v36.14,65.66
IR_IN3  (via drill 0.41)
  Top 0.254: U1.10 43.94,40.13 v44.2,40.39 | R9.2 42.93,70.39 v42.93,65.66
  Top 0.406: U$4.P$E 42.98,74.31 42.98,70.63 R9.2
  Bottom 0.254: v42.93,65.66 42.93,56.9 48.01,51.82 48.01,44.2 v44.2,40.39
IR_IN4  (via drill 0.41)
  Top 0.254: v45.21,40.39 44.48,39.65 U1.11 | v57.66,54.1 61.73,54.1 R10.2
  Top 0.406: R10.2 64.53,54.6 U$5.P$E
  Bottom 0.254: v45.21,40.39 48.51,43.69 48.51,52.58 50.04,54.1 v57.66,54.1
IR_OUT1  (via drill 0.41)
  Top 0.254: v22.73,50.42 22.1,51.05 R11.2 | v41.66,43.69 44.2,43.69 49.25,38.63 U1.36
  Bottom 0.254: v41.66,43.69 35.81,49.53 23.62,49.53 v22.73,50.42
IR_OUT2
  Top 0.254: R12.2 38.22,60.45 53.85,60.45 56.39,57.91 56.39,40.89 53.64,38.15 U1.35
IR_OUT3
  Top 0.254: R13.2 53.99,61.33 56.9,58.42 56.9,40.64 53.9,37.64 U1.34
IR_OUT4
  Top 0.254: R14.2 57.4,45.86 57.4,40.39 54.15,37.13 U1.33
JTAG-TCK  (via drill 0.41)
  Top 0.254: v50.27,46.76 50.01,46.51 U1.49
  Bottom 0.254: v50.27,46.76 50.8,47.29 U$1.7
JTAG-TDO  (via drill 0.41)
  Top 0.254: U1.55 46.48,45.47 46.74,45.21 50.04,45.21 v50.55,45.72
  Bottom 0.254: v50.55,45.72 52.07,47.24 52.07,51.56 U$1.5
JTAG-TMS  (via drill 0.41)
  Top 0.254: U$1.3 52.07,54.1 52.07,48.26 v53.34,46.99 | v53.34,43.18 52.88,43.64 U1.46
  Bottom 0.254: v53.34,46.99 v53.34,43.18
LED1
  Top 0.254: U1.24 45.47,31.75 46.74,30.48 51.42,30.48 52.95,32 R15.2
LED2
  Top 0.254: U1.25 45.97,32 46.99,30.99 51.31,30.99 51.82,31.5 51.82,32.14 R16.2
LED3
  Top 0.254: U1.26 46.48,32.26 47.24,31.5 51.05,31.5 51.31,31.75 51.31,33.16 R17.2
M1+  (via drill 0.5)
  Top 0.254: 21.54,39.5 21.74,39.5 U5.5 U5.6
  Top 1.016: v25.15,39.55 25.09,39.5 21.54,39.5
  Bottom 1.016: v25.15,39.55 25.15,38.1 32.51,30.73 39.12,30.73 40.64,29.21 40.64,8.25 JP4.1
M1-  (via drill 0.5)
  Top 0.254: 21.74,42.11 U5.1 | 21.54,42.11 21.74,42.11 | 21.74,42.11 U5.2
  Top 1.016: v24.69,42.11 21.54,42.11
  Bottom 1.016: v24.69,42.11 26.42,40.39 26.42,38.71 33.12,32 39.88,32 41.91,29.97 41.91,10.79 JP4.2
M1CA  (via drill 0.41)
  Top 0.254: v58.93,36.32 58.67,36.58 55.63,36.58 55.12,36.07 50.29,36.07 49.28,37.08 v49.02,37.08 | v49.02,39.88 44.48,44.42 U1.59
  Bottom 0.254: v58.93,36.32 60.45,34.8 60.45,31.5 63.88,28.07 63.88,14.48 60.2,10.79 JP4.6 | v49.02,37.08 v49.02,39.88
M1CB  (via drill 0.41)
  Top 0.254: JP4.5 57.66,8.25 63.88,14.48 63.88,28.07 60.45,31.5 60.45,35.81 58.88,37.39 55.42,37.39 54.61,36.58 50.55,36.58 49.78,37.34 v49.78,37.85 | v48.77,41.15 44.96,44.96 U1.58
  Bottom 0.254: v48.77,41.15 49.78,40.13 v49.78,37.85
M1I1  (via drill 0.41)
  Top 0.254: U5.21 30.38,40.49 v31.5,39.37 | v40.13,36.07 41.17,36.07 U1.17
  Bottom 0.254: v31.5,39.37 34.8,36.07 v40.13,36.07
M1I2  (via drill 0.41)
  Top 0.254: U5.22 30.74,41.14 v31.5,40.39 | v37.59,36.83 39.8,36.83 U1.16
  Bottom 0.254: v31.5,40.39 35.05,36.83 v37.59,36.83
M1P  (via drill 0.41)
  Top 0.254: U5.23 31.11,41.79 v31.5,41.4 | U1.15 v38.41,37.64 38.35,37.64
  Bottom 0.254: v31.5,41.4 35.25,37.64 v38.41,37.64
M2+  (via drill 0.5)
  Top 0.254: 21.74,38.2 U5.7 | 21.54,38.2 21.74,38.2 | 21.74,38.2 U5.8
  Top 1.016: v23.88,38.1 23.88,38.2 21.54,38.2
  Bottom 1.016: v23.88,38.1 23.88,37.59 32,29.46 38.35,29.46 39.37,28.45 39.37,10.79 JP3.1
M2-  (via drill 0.5)
  Top 0.254: U5.11 U5.12 21.84,35.29 21.84,35.61
  Top 1.016: v29.97,29.46 38.35,29.46 39.37,28.45 39.37,10.79 33.98,10.79 31.5,8.25 JP3.2 | 21.54,35.61 21.84,35.61 22.94,35.61 23.42,35.13 v23.42,34.9
  Bottom 1.016: v29.97,29.46 28.19,31.24 26.42,31.24 23.42,34.24 v23.42,34.9
M2CA  (via drill 0.41)
  Top 0.254: v54.1,39.62 53.62,39.65 U1.38
  Bottom 0.254: JP3.6 27.13,6.53 58.6,6.53 59.44,7.37 59.44,9.4 64.39,14.35 64.39,28.32 60.96,31.75 60.96,37.36 58.45,39.62 v54.1,39.62
M2CB  (via drill 0.41)
  Top 0.254: v58.42,38.61 60.96,36.07 60.96,31.75 64.39,28.32 64.39,14.35 58.34,8.31 v58.34,7.54 | v53.34,38.86 53.06,39.14 U1.37
  Bottom 0.254: JP3.5 26.67,9.53 26.67,7.62 27.33,6.96 57.76,6.96 v58.34,7.54 | v53.34,38.86 58.17,38.86 v58.42,38.61
M2I1  (via drill 0.41)
  Top 0.254: U5.17 30.95,37.89 v31.5,37.34 | v44.2,36.83 43.97,36.6 U1.21
  Bottom 0.254: v31.5,37.34 34.29,34.54 41.91,34.54 v44.2,36.83
M2I2  (via drill 0.41)
  Top 0.254: v31.5,36.32 30.58,37.24 U5.16 | v43.69,33.78 43.94,33.78 44.48,34.31 U1.22
  Bottom 0.254: v31.5,36.32 34.04,33.78 v43.69,33.78
M2P  (via drill 0.41)
  Top 0.254: v31.5,35.31 30.21,36.59 U5.15 | U1.23 44.96,33.27 v44.7,33.02
  Bottom 0.254: v31.5,35.31 33.78,33.02 v44.7,33.02
N$2
  Top 0.254: U1.5 39.14,42.65 38.35,43.43 37.4,43.43 Q1.3
  Top 0.406: Q1.3 33.95,45.28 C12.2
N$3
  Top 0.406: R4.1 33.73,61.33 T6.3
N$4
  Top 0.813: T5.2 9.84,48.58 LED1.A
N$5  (via drill 0.5)
  Top 0.813: v32.79,67.28 33.34,66.74 T6.2
  Bottom 0.813: LED2.A 31.38,68.7 v32.79,67.28
N$6
  Top 0.254: U1.6 38.41,42.14 Q1.1
  Top 0.406: C13.2 36.21,39.94 Q1.1
N$7  (via drill 0.5)
  Top 0.813: v47.5,67.31 46.04,65.85 T7.2
  Bottom 0.813: LED3.A 49.9,69.71 v47.5,67.31
N$9
  Top 0.254: U4.20 41.42,59.34 C20.1
N$10
  Top 0.254: U4.10 40.92,52.44 C18.1
N$14
  Top 0.813: LED4.A 71.44,50.48 T8.2
N$15
  Top 0.406: T5.3 R3.1
N$16
  Top 0.406: R5.1 46.43,61.33 T7.3
N$17
  Top 0.406: R6.1 T8.3
N$22
  Top 0.813: R14.1 65.8,48.01 T8.1
N$23
  Top 0.813: T7.1 48.82,64.09 R13.1
N$24
  Top 0.813: T6.1 36.38,64.09 R12.1
N$25
  Top 0.813: T5.1 15.48,51.05 R11.1
N$26
  Top 0.254: R15.1 LED5.A
N$27
  Top 0.254: R16.1 LED6.A
N$28
  Top 0.254: LED7.A R17.1
N$31
  Top 0.406: R22.1 R19.1 29.86,54.27 S1.1
RST  (via drill 0.41)
  Top 0.254: v46.23,40.39 43.94,42.67 42.16,42.67 41.15,41.66 U1.7 | v49.28,49.78 49.28,56.39 U$1.1
  Bottom 0.254: v49.28,49.78 49.28,43.69 v46.23,40.39
STBY  (via drill 0.41)
  Top 0.254: U5.19 30.41,39.19 v31.5,38.35 | v43.18,36.83 43.46,36.55 U1.20
  Bottom 0.254: v31.5,38.35 34.54,35.31 41.66,35.31 v43.18,36.83
USART1_RX
  Top 0.254: U$1.6 55.37,50.8 55.37,42.42 54.61,41.66 53.85,41.66 53.36,42.14 U1.43
USART1_TX
  Top 0.254: U$1.4 55.88,52.83 55.88,42.16 54.86,41.15 53.59,41.15 53.09,41.66 U1.42
V_BATT
  Top 0.254: U5.13 U5.14 29.21,35.94 29.21,35.61
  Top 0.406: U5.24 26.69,42.44 26.42,42.16
  Top 1.016: IC1.3 36.77,1.24 C8.1 32.8,2.2 X1.1 32.75,5.85 34.27,7.37 37.85,7.37 40.64,10.16 40.64,29.21 39.12,30.73 26.92,30.73 C15.A | 26.42,42.16 26.42,35.61 | 26.42,35.61 29.21,35.61 29.29,35.61 | 26.42,35.61 24.77,33.96 C15.A | C15.A C19.1
VCC  (via drill 0.41, 0.5)
  Top 0.254: U1.19 42.98,33.11 C7.1 43.81,32.26 | C4.1 49.48,33.21 U1.32 49.48,35.05 v50.8,35.05 | 41.96,46.94 U1.64 41.96,47.19 v41.27,47.88 | C3.1 39.62,45.14 U1.1 | U1.48 53.02,44.65 C5.1 | U1.48 51.19,44.65 | U4.8 39.88,52.46 C21.1 | U4.13 44.56,54.33 C16.2 | v52.46,45.97 51.33,44.84 U1.48
  Top 0.305: U5.20 28.23,39.84 27.69,40.39 v27.69,41.4
  Top 0.406: R1.2 R2.2 46.62,48.88 v46.74,48.77 | R1.2 46.62,56.53 49.53,59.44 51.82,59.44 U$1.2 | R1.2 46.6,52.32 C16.2 | C21.1 36.07,51.95 | 36.07,51.95 36.07,47.88 | S1.2 33.25,54.78 36.07,51.95
  Top 0.61: v27.69,43.43 26.92,44.2 C17.1 24.57,45.67 U3.2 22.08,45.67 C11.1 v17.77,45.58 | v32,45.21 34.67,47.88 36.07,47.88 38.1,47.88 | 38.1,47.88 39.62,47.88 | 39.62,47.88 v41.27,47.88 | C6.1 38.1,47.88 | C3.1 39.62,47.88 | v46.74,48.77 49.67,48.77 v52.46,45.97 | 43.81,32.26 v45.09,30.99
  Bottom 0.305: v27.69,41.4 v27.69,43.43
  Bottom 0.61: v27.69,43.43 30.23,43.43 v32,45.21 | v41.27,47.88 45.85,47.88 v46.74,48.77 | v45.09,30.99 49.28,30.99 50.8,32.51 v50.8,35.05 52.46,36.71 v52.46,45.97 | U$5.P$C 65.84,60.76 51.05,75.36 45.95,75.36 U$4.P$C 43.89,73.38 U$3.P$C 34.84,75.36 29.64,75.36 15.04,60.76 U$2.P$C 15.04,46.51 15.97,45.58 v17.77,45.58
VDD
  Top 0.254: U1.13 36.48,38.63 C1.1 | 37.49,35.23 C10.1
  Top 0.406: C1.1 C2.1 36.21,35.23 | 37.49,35.23 36.21,35.23 | 36.21,35.23 U2.2

### Text on the board
tPlace: TEAM7